# EAGLE design imax_atmega (EAGLE 8.2.1)
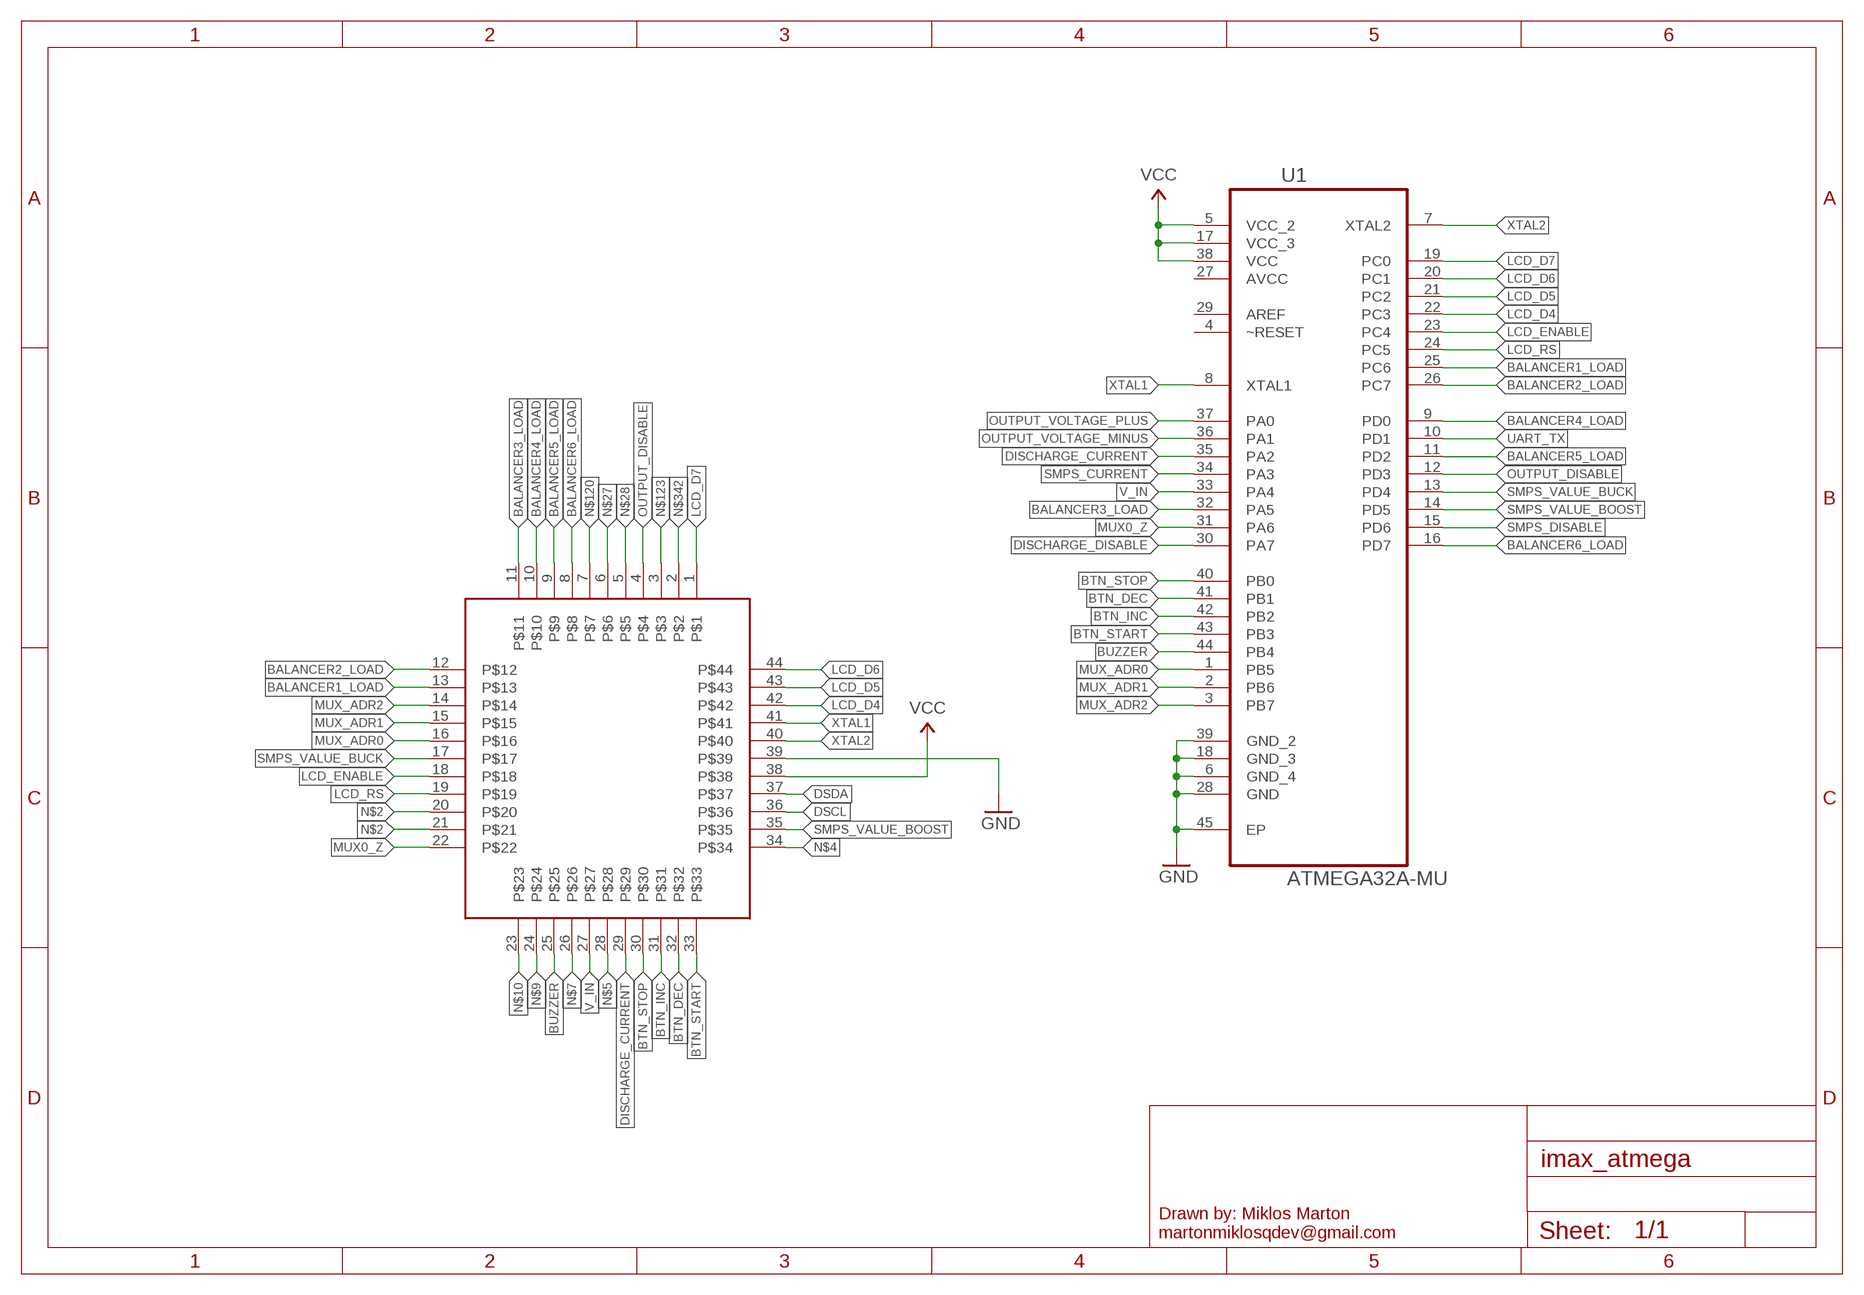
[diagram p0: schematic, sheet 1]

## Parts
U1  ATMEGA32A-MU  [QFN50P700X700X100-45N]
U$1  ABOV_BOB  [TQPF44_BOB]

## Nets
BALANCER1_LOAD: U1.25(PC6) U$1.13
BALANCER2_LOAD: U1.26(PC7) U$1.12
BALANCER3_LOAD: U1.32(PA5) U$1.11
BALANCER4_LOAD: U1.9(PD0) U$1.10
BALANCER5_LOAD: U1.11(PD2) U$1.9
BALANCER6_LOAD: U1.16(PD7) U$1.8
BTN_DEC: U1.41(PB1) U$1.32
BTN_INC: U1.42(PB2) U$1.31
BTN_START: U1.43(PB3) U$1.33
BTN_STOP: U1.40(PB0) U$1.30
BUZZER: U1.44(PB4) U$1.25
DISCHARGE_CURRENT: U1.35(PA2) U$1.29
DISCHARGE_DISABLE: U1.30(PA7)
DSCL: U$1.36
DSDA: U$1.37
GND: U1.6(GND_4) U1.18(GND_3) U1.28(GND) U1.39(GND_2) U1.45(EP) U$1.39
LCD_D4: U1.22(PC3) U$1.42
LCD_D5: U1.21(PC2) U$1.43
LCD_D6: U1.20(PC1) U$1.44
LCD_D7: U1.19(PC0) U$1.1
LCD_ENABLE: U1.23(PC4) U$1.18
LCD_RS: U1.24(PC5) U$1.19
MUX0_Z: U1.31(PA6) U$1.22
MUX_ADR0: U1.1(PB5) U$1.16
MUX_ADR1: U1.2(PB6) U$1.15
MUX_ADR2: U1.3(PB7) U$1.14
N$2: U$1.20
N$3: U$1.21
N$4: U$1.34
N$5: U$1.28
N$7: U$1.26
N$9: U$1.24
N$10: U$1.23
N$27: U$1.6
N$28: U$1.5
N$120: U$1.7
N$123: U$1.3
N$342: U$1.2
OUTPUT_DISABLE: U1.12(PD3) U$1.4
OUTPUT_VOLTAGE_MINUS: U1.36(PA1)
OUTPUT_VOLTAGE_PLUS: U1.37(PA0)
SMPS_CURRENT: U1.34(PA3)
SMPS_DISABLE: U1.15(PD6)
SMPS_VALUE_BOOST: U1.14(PD5) U$1.35
SMPS_VALUE_BUCK: U1.13(PD4) U$1.17
UART_TX: U1.10(PD1)
V_IN: U1.33(PA4) U$1.27
VCC: U1.5(VCC_2) U1.17(VCC_3) U1.38(VCC) U$1.38
XTAL1: U1.8(XTAL1) U$1.41
XTAL2: U1.7(XTAL2) U$1.40
Unconnected: U1.4(~RESET) U1.29(AREF)

## Power pins joined to a net without a drawn wire
AVCC: U1.27(AVCC)

## Library data of the parts
U1 = Atmel_By_element14_Batch_1-00:ATMEGA32A-MU: 8-bit Microcontroller with 32K Bytes In-System Programmable Flash; MPN: ATMEGA32A-MU; OC_FARNELL: 1748523; OC_NEWARK: 26R5631; PACKAGE: QFN-44; SUPPLIER: Atmel
U$1 = abov_footprint:ABOV_BOB

## Board
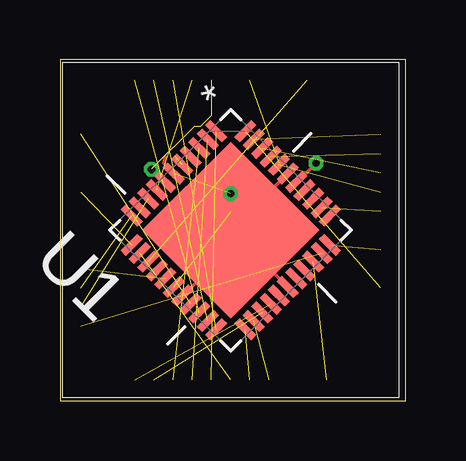
[diagram p1: board, top side]
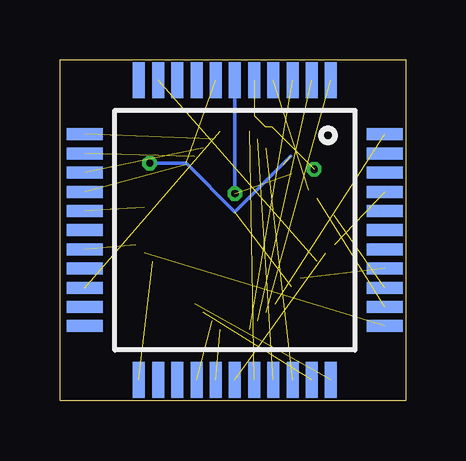
[diagram p2: board, bottom side, seen from below]

Size 14.4 x 14.21 mm. Coordinates in mm from the lower left corner, seen from the top.
Outline: 0,0 14.4,0 14.4,14.21 0,14.21 0,0
Copper layers (1*16): Top 0.035mm / dielectric 1.5mm / Bottom 0.035mm
Design rules "dirt_cheap_dirty_boards.v1": minimum track width 5mil, minimum drill 0.3mm, track to track 6mil, track to pad 6mil, pad to pad 6mil, via to via 6mil, smd to smd 0mil, copper to edge 10mil, drill to drill 10mil, minimum pad ring 10mil, minimum via ring 6mil, stop-mask expansion 2mil, vias tented up to drill 25mil, thermal gap 10mil

### Footprints (pad centres in the part's own frame; a part is rotated, then mirrored left to right if it is on the bottom)
QFN50P700X700X100-45N = smd 0.991 x 0.305: 1 -3.353,2.489; 2 -3.353,2.007; 3 -3.353,1.499; 4 -3.353,0.991; 5 -3.353,0.508; 6 -3.353,0; 7 -3.353,-0.508; 8 -3.353,-0.991; 9 -3.353,-1.499; 10 -3.353,-2.007; 11 -3.353,-2.489; 23 3.353,-2.489; 24 3.353,-2.007; 25 3.353,-1.499; 26 3.353,-0.991; 27 3.353,-0.508; 28 3.353,0; 29 3.353,0.508; 30 3.353,0.991; 31 3.353,1.499; 32 3.353,2.007; 33 3.353,2.489 | smd 0.305 x 0.991: 12 -2.489,-3.353; 13 -2.007,-3.353; 14 -1.499,-3.353; 15 -0.991,-3.353; 16 -0.508,-3.353; 17 0,-3.353; 18 0.508,-3.353; 19 0.991,-3.353; 20 1.499,-3.353; 21 2.007,-3.353; 22 2.489,-3.353; 34 2.489,3.353; 35 2.007,3.353; 36 1.499,3.353; 37 0.991,3.353; 38 0.508,3.353; 39 0,3.353; 40 -0.508,3.353; 41 -0.991,3.353; 42 -1.499,3.353; 43 -2.007,3.353; 44 -2.489,3.353 | smd 5.207 x 5.207: 45 0,0
TQPF44_BOB = smd 1.5 x 0.5 bottom: 1 -6.25,4; 2 -6.25,3.2; 3 -6.25,2.4; 4 -6.25,1.6; 5 -6.25,0.8; 6 -6.25,0; 7 -6.25,-0.8; 8 -6.25,-1.6; 9 -6.25,-2.4; 10 -6.25,-3.2; 11 -6.25,-4; 23 6.25,-4; 24 6.25,-3.2; 25 6.25,-2.4; 26 6.25,-1.6; 27 6.25,-0.8; 28 6.25,0; 29 6.25,0.8; 30 6.25,1.6; 31 6.25,2.4; 32 6.25,3.2; 33 6.25,4 | smd 0.5 x 1.5 bottom: 12 -4,-6.25; 13 -3.2,-6.25; 14 -2.4,-6.25; 15 -1.6,-6.25; 16 -0.8,-6.25; 17 0,-6.25; 18 0.8,-6.25; 19 1.6,-6.25; 20 2.4,-6.25; 21 3.2,-6.25; 22 4,-6.25; 34 4,6.25; 35 3.2,6.25; 36 2.4,6.25; 37 1.6,6.25; 38 0.8,6.25; 39 0,6.25; 40 -0.8,6.25; 41 -1.6,6.25; 42 -2.4,6.25; 43 -3.2,6.25; 44 -4,6.25

### Placement (x,y rotation side)
U1  7.11,7.11 315 top
U$1  7.11,7.11 0 top

### Tracks (layer width: path | path; a pad name or v marks a point on that pad's centre or on a via)
BALANCER1_LOAD  (1 unrouted)
BALANCER2_LOAD  (1 unrouted)
BALANCER3_LOAD  (1 unrouted)
BALANCER4_LOAD  (1 unrouted)
BALANCER5_LOAD  (1 unrouted)
BALANCER6_LOAD  (1 unrouted)
BTN_DEC  (1 unrouted)
BTN_INC  (1 unrouted)
BTN_START  (1 unrouted)
BTN_STOP  (1 unrouted)
BUZZER  (1 unrouted)
DISCHARGE_CURRENT  (1 unrouted)
GND  (via drill 0.3 pad 0.6)  (1 unrouted)
  Top 0.152: U1.6 4.32,9.91 4.39,10.16 | U1.18 5.14,4.38 6.1,5.33 6.1,6.1 U1.45 | U1.28 U1.45 | 7.75,7.75 U1.45 | 7.75,7.75 U1.39 | 7.11,8.38 v7.11,8.64 | 7.11,8.38 7.75,7.75 | U1.45 7.11,8.38
  Bottom 0.152: U$1.39 v7.11,8.64
LCD_D4  (1 unrouted)
LCD_D5  (1 unrouted)
LCD_D6  (1 unrouted)
LCD_D7  (1 unrouted)
LCD_ENABLE  (1 unrouted)
LCD_RS  (1 unrouted)
MUX0_Z  (1 unrouted)
MUX_ADR0  (1 unrouted)
MUX_ADR1  (1 unrouted)
MUX_ADR2  (1 unrouted)
OUTPUT_DISABLE  (1 unrouted)
SMPS_VALUE_BOOST  (1 unrouted)
SMPS_VALUE_BUCK  (1 unrouted)
V_IN  (1 unrouted)
VCC  (via drill 0.3 pad 0.6)  (3 unrouted)
  Top 0.152: U1.38 9.89,9.12 v10.67,9.91
  Bottom 0.152: v10.67,9.91 9.14,9.91 7.11,7.87 4.79,10.2
XTAL1  (1 unrouted)
XTAL2  (via drill 0.3 pad 0.6)  (4 unrouted)
  Top 0.152: U1.7 4.34,9.12 v3.81,9.65